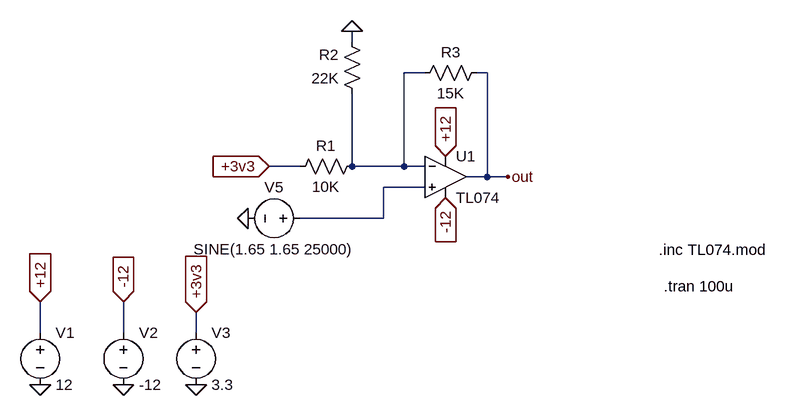
[diagram p0: schematic Draft4.asc]
Draft4.asc, the LTspice schematic file:
Version 4
SHEET 1 900 680
WIRE 256 128 256 112
WIRE 368 176 336 176
WIRE 464 176 448 176
WIRE 176 320 128 320
WIRE 256 320 256 208
WIRE 336 320 336 176
WIRE 336 320 256 320
WIRE 368 320 336 320
WIRE 464 336 464 176
WIRE 464 336 432 336
WIRE 496 336 464 336
WIRE 368 352 304 352
WIRE 304 400 304 352
WIRE 304 400 176 400
WIRE -224 576 -224 528
WIRE -96 576 -96 528
WIRE 16 576 16 544
FLAG 400 368 -12
IOPIN 400 368 In
FLAG 400 304 +12
IOPIN 400 304 In
FLAG 256 112 0
FLAG -224 656 0
FLAG -96 656 0
FLAG -224 528 +12
IOPIN -224 528 In
FLAG -96 528 -12
IOPIN -96 528 In
FLAG 16 544 +3v3
IOPIN 16 544 In
FLAG 16 656 0
FLAG 96 400 0
FLAG 128 320 +3v3
IOPIN 128 320 In
FLAG 496 336 out
SYMBOL Opamps/opamp2 400 272 R0
SYMATTR InstName U1
SYMATTR Value TL074
SYMBOL voltage -224 560 R0
SYMATTR InstName V1
SYMATTR Value 12
SYMBOL voltage -96 560 R0
SYMATTR InstName V2
SYMATTR Value -12
SYMBOL voltage 16 560 R0
SYMATTR InstName V3
SYMATTR Value 3.3
SYMBOL res 272 304 R90
WINDOW 0 0 56 VBottom 2
WINDOW 3 32 56 VTop 2
SYMATTR InstName R1
SYMATTR Value 10K
SYMBOL res 272 224 R180
WINDOW 0 36 76 Left 2
WINDOW 3 36 40 Left 2
SYMATTR InstName R2
SYMATTR Value 22K
SYMBOL voltage 192 400 R90
WINDOW 0 -32 56 VBottom 2
WINDOW 3 32 56 VTop 2
SYMATTR InstName V5
SYMATTR Value SINE(1.65 1.65 25000)
SYMATTR Value2 AC 11
SYMBOL res 464 160 R90
WINDOW 0 0 56 VBottom 2
WINDOW 3 32 56 VTop 2
SYMATTR InstName R3
SYMATTR Value 15K
TEXT 728 448 Left 2 !.inc TL074.mod
TEXT 736 504 Left 2 !.tran 100u

The netlist it stands for:
* Draft4.asc
XU1 N002 N001 +12 -12 out TL074  ; pins In+ In- V+ V- OUT
V1 +12 0 12
V2 -12 0 -12
V3 +3v3 0 3.3
R1 N001 +3v3 10K
R2 N001 0 22K
V5 N002 0 SINE(1.65 1.65 25000) AC 11
R3 out N001 15K
.inc TL074.mod
.tran 100u
.backanno
.end